# Altium schematic sheet main.SchDoc: Main Board Schematic
size A3; Author: Nguyễn Hữu Thắng; DrawnBy: Nguyễn Hữu Thắng; SheetNumber: 1; SheetTotal: 35; ENG_APP_DATE: --/--/--; DSN_APP_DATE: --/--/--; CHK_APP_DATE: --/--/--
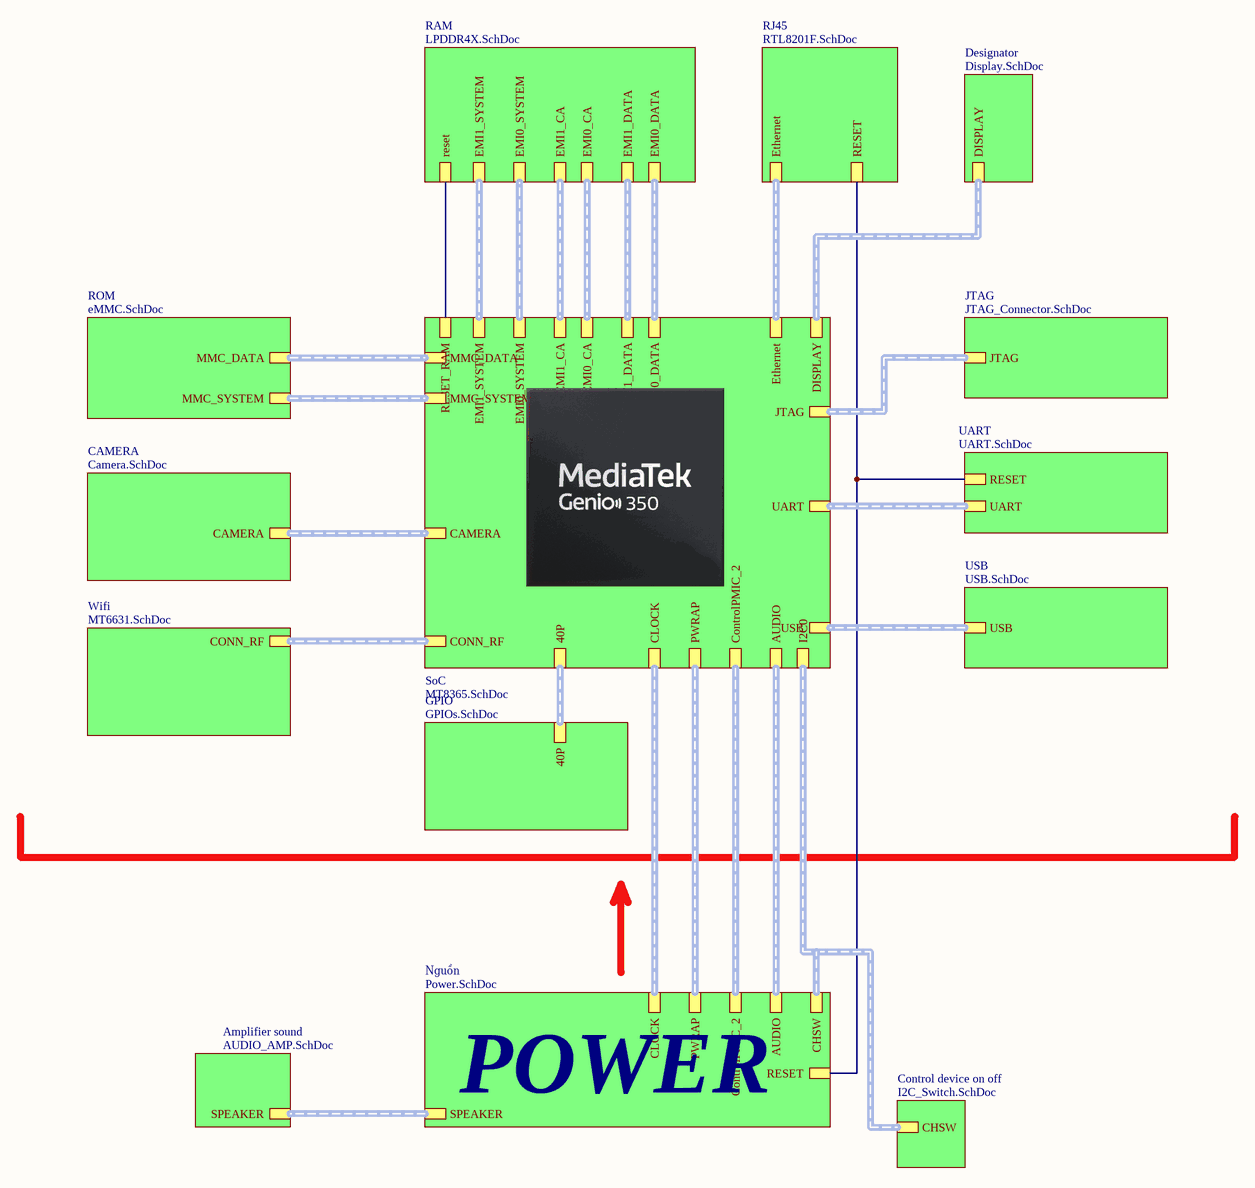
[diagram p0: main.SchDoc]

## Sub-sheets
Amplifier sound = AUDIO_AMP.SchDoc: SPEAKER
CAMERA = Camera.SchDoc: CAMERA
Control device on off = I2C_Switch.SchDoc: CHSW
Designator = Display.SchDoc: DISPLAY
GPIO = GPIOs.SchDoc: 40P
JTAG = JTAG_Connector.SchDoc: JTAG
Nguồn = Power.SchDoc: PWRAP, ControlPMIC_2, CLOCK, AUDIO, CHSW, SPEAKER, RESET
RAM = LPDDR4X.SchDoc: EMI0_DATA, EMI1_DATA, EMI0_CA, EMI1_CA, EMI1_SYSTEM, EMI0_SYSTEM, reset
RJ45 = RTL8201F.SchDoc: Ethernet, RESET
ROM = eMMC.SchDoc: MMC_DATA, MMC_SYSTEM
SoC = MT8365.SchDoc: EMI0_DATA, EMI1_DATA, EMI0_CA, EMI1_CA, EMI0_SYSTEM, EMI1_SYSTEM, MMC_DATA, RESET_RAM, MMC_SYSTEM, PWRAP, ControlPMIC_2, CLOCK, CONN_RF, AUDIO, Ethernet, UART, USB, CAMERA, DISPLAY, 40P, I2C0, JTAG
UART = UART.SchDoc: UART, RESET
USB = USB.SchDoc: USB
Wifi = MT6631.SchDoc: CONN_RF

## Nets
(unnamed): sheet SoC/RESET_RAM, sheet RAM/reset
(unnamed): sheet UART/RESET, sheet RJ45/RESET, sheet Nguồn/RESET

## Buses and harness runs
harness sheet Amplifier sound/SPEAKER = sheet Nguồn/SPEAKER
harness sheet CAMERA/CAMERA = sheet SoC/CAMERA
harness sheet Control device on off/CHSW = sheet Nguồn/CHSW = sheet SoC/I2C0
harness sheet Designator/DISPLAY = sheet SoC/DISPLAY
harness sheet GPIO/40P = sheet SoC/40P
harness sheet JTAG/JTAG = sheet SoC/JTAG
harness sheet Nguồn/AUDIO = sheet SoC/AUDIO
harness sheet Nguồn/CLOCK = sheet SoC/CLOCK
harness sheet Nguồn/ControlPMIC_2 = sheet SoC/ControlPMIC_2
harness sheet Nguồn/PWRAP = sheet SoC/PWRAP
harness sheet RAM/EMI0_CA = sheet SoC/EMI0_CA
harness sheet RAM/EMI0_DATA = sheet SoC/EMI0_DATA
harness sheet RAM/EMI0_SYSTEM = sheet SoC/EMI0_SYSTEM
harness sheet RAM/EMI1_CA = sheet SoC/EMI1_CA
harness sheet RAM/EMI1_DATA = sheet SoC/EMI1_DATA
harness sheet RAM/EMI1_SYSTEM = sheet SoC/EMI1_SYSTEM
harness sheet RJ45/Ethernet = sheet SoC/Ethernet
harness sheet ROM/MMC_DATA = sheet SoC/MMC_DATA
harness sheet ROM/MMC_SYSTEM = sheet SoC/MMC_SYSTEM
harness sheet SoC/CONN_RF = sheet Wifi/CONN_RF
harness sheet SoC/UART = sheet UART/UART
harness sheet SoC/USB = sheet USB/USB

## Notes on the sheet
- POWER
- THIS DOCUMENT AND THE DATA DISCLOSED HEREIN OR
- HEREWITH IS THE PROPERTY OF ALTIUM LIMITED AND MAY
- DWG NO:
- REVISION
- REV:
- DESCRIPTION
- DATE
- APPROVED
- BE FREELY DISTRIBUTED IN WHOLE. NO RIGHTS ARE
- RESERVED OR EXPRESS OR IMPLIED WARANTEE GIVEN.
- ENG:
- APPROVALS
- PROJECT
- DSN:
- CHK:
- REFERENCE DOCUMENTS
- PROJECT REVISION:
- TITLE
- DOCUMENT REVISION:
- DESIGN ITEM:
- BOM:
- FAB DWG:
- PCB DWG:
- ASSY DWG:
- SCALE:
- A3
- SIZE
- CAGE CODE
- FILE NAME
- DWG NO.
- SHEET
- OF
- REV